# EAGLE design DataLogger.ver1 (EAGLE 9.6.2)
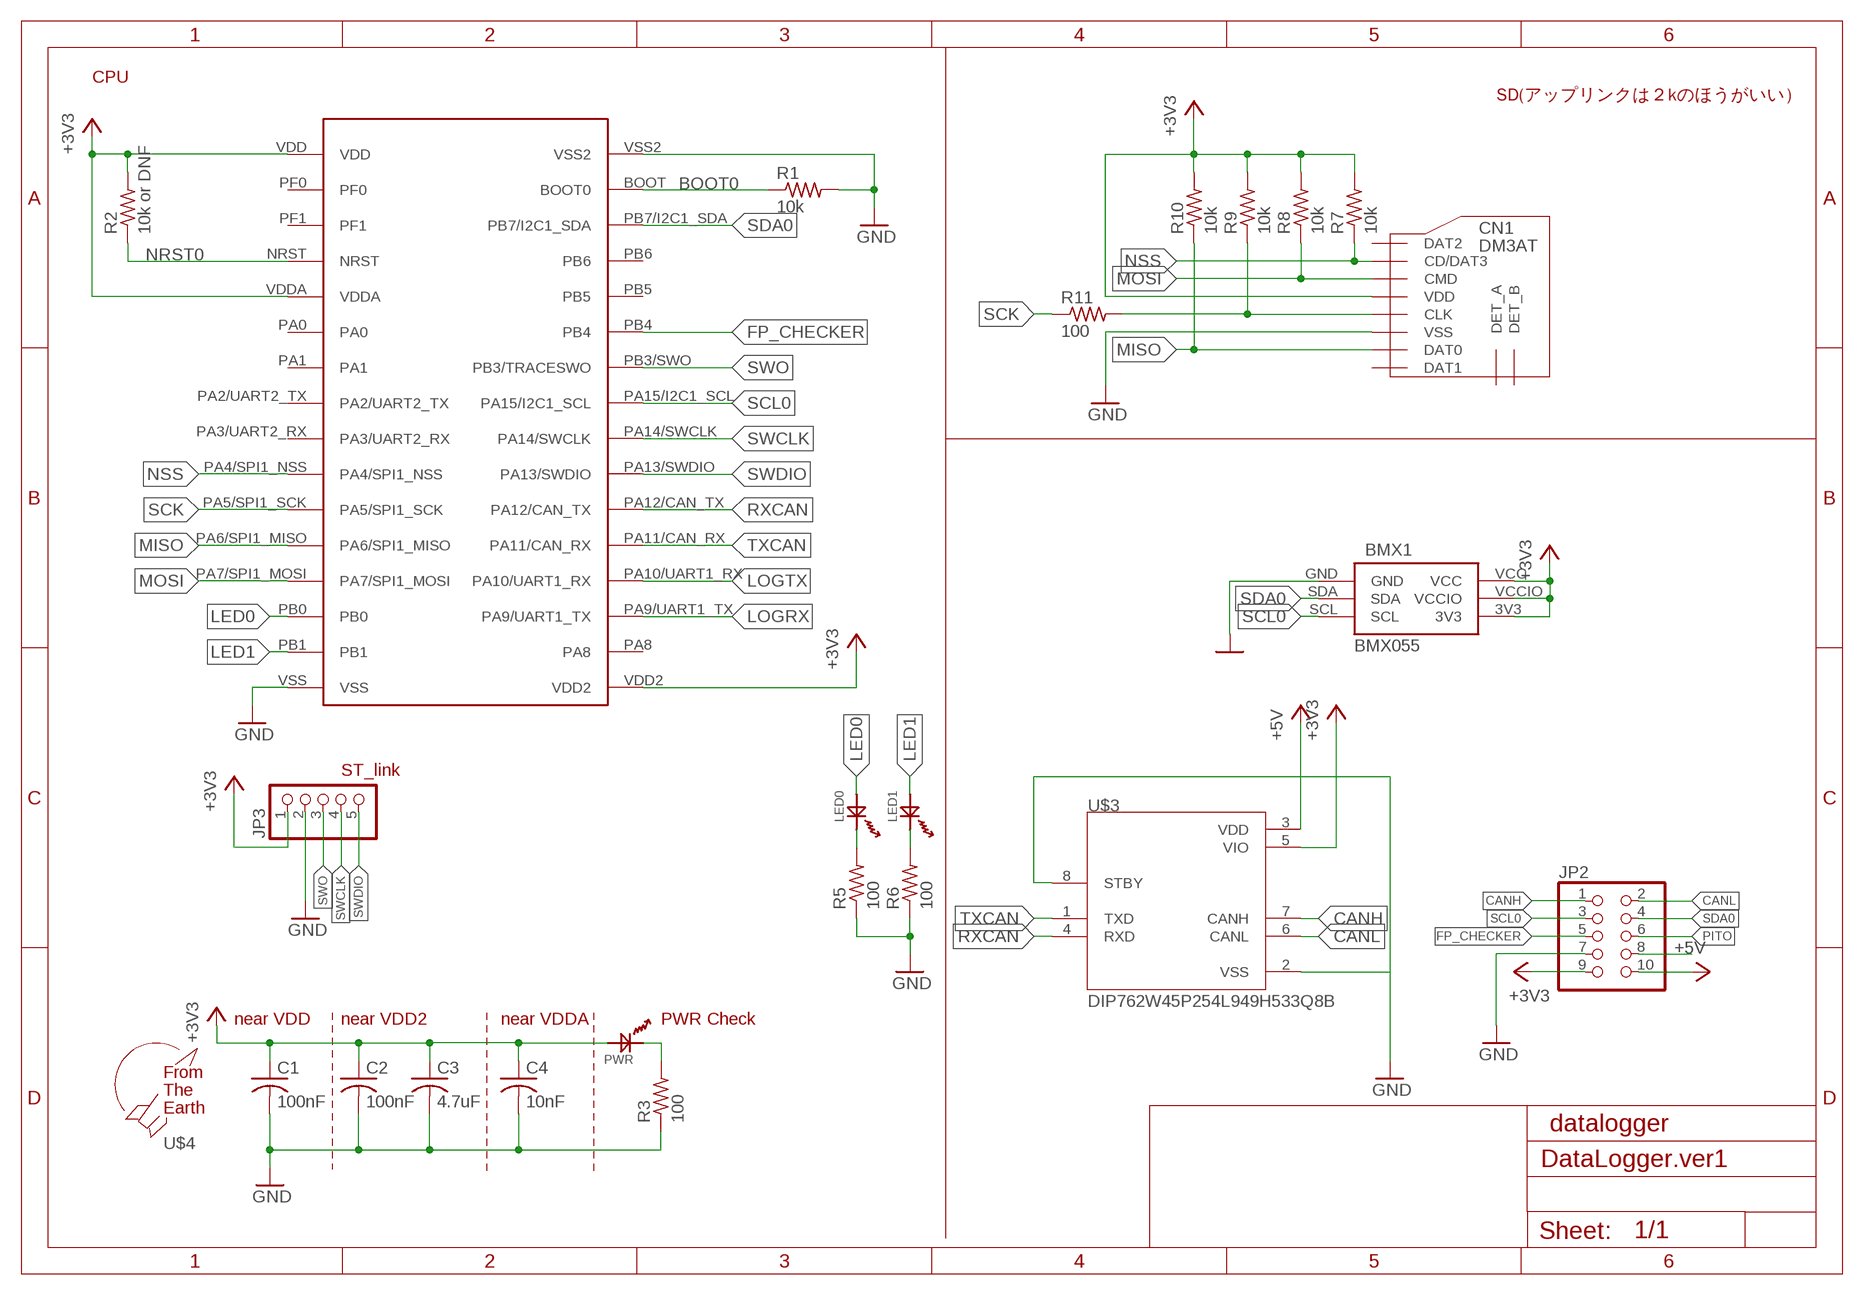
[diagram p0: schematic, sheet 1]

## Parts
BMX1  BMX055  [BMX055]
C1  100nF  C-USC1608  [C1608]
C2  100nF  C-USC1608  [C1608]
C3  4.7uF  C-USC1608  [C1608]
C4  10nF  C-USC1608  [C1608]
CN1  DM3AT  [DM3AT]
JP2  PINHD-2X5/90  [2X05/90]
JP3  PINHD-1X5/90  [1X05/90]
LED0  OSXX1608C1A  [OSXX1608C1A]
LED1  OSXX1608C1A  [OSXX1608C1A]
PWR  OSXX1608C1A  [OSXX1608C1A]
R1  10k  R-US_R0603  [R0603]
R2  10k or DNF  R-US_R0603  [R0603]
R3  100  R-US_R0603  [R0603]
R5  100  R-US_R0603  [R0603]
R6  100  R-US_R0603  [R0603]
R7  10k  R-US_R0603  [R0603]
R8  10k  R-US_R0603  [R0603]
R9  10k  R-US_R0603  [R0603]
R10  10k  R-US_R0603  [R0603]
R11  100  R-US_R0603  [R0603]
STM0  STM32F303K8  [STM32F303K8]
U$3  DIP762W45P254L949H533Q8B  [DIP762W45P254L949H533Q8B]
U$4  F.T.E.LOGO  [LOGO]

## Nets
+3V3: BMX1.3V3 BMX1.VCC BMX1.VCCIO C1.1 C2.1 C3.1 C4.1 CN1.VDD JP2.9 JP3.1 PWR.AN R2.2 R7.2 R8.2 R9.2 R10.2 STM0.VDD STM0.VDD2 STM0.VDDA U$3.5(VIO)
+5V: JP2.10 U$3.3(VDD)
BOOT0: R1.1 STM0.BOOT(BOOT0)
CANH: JP2.1 U$3.7(CANH)
CANL: JP2.2 U$3.6(CANL)
FP_CHECKER: JP2.5 STM0.PB4
GND [im]: BMX1.GND C1.2 C2.2 C3.2 C4.2 CN1.VSS JP2.7 JP3.2 R1.2 R3.1 R5.1 R6.1 STM0.VSS STM0.VSS2 U$3.2(VSS) U$3.8(STBY)
LED0: LED0.AN STM0.PB0
LED1: LED1.AN STM0.PB1
LOGRX: STM0.PA9/UART1_TX
LOGTX: STM0.PA10/UART1_RX
MISO: CN1.DAT0 R10.1 STM0.PA6/SPI1_MISO
MOSI: CN1.CMD R8.1 STM0.PA7/SPI1_MOSI
N$1: PWR.CT R3.2
N$2: LED0.CT R5.2
N$4: LED1.CT R6.2
N$7: CN1.CLK R9.1 R11.2
N$11: JP2.8
NRST0: R2.1 STM0.NRST
NSS: CN1.CD/DAT3 R7.1 STM0.PA4/SPI1_NSS
PITO: JP2.6
RXCAN: STM0.PA12/CAN_TX U$3.4(RXD)
SCK: R11.1 STM0.PA5/SPI1_SCK
SCL0: BMX1.SCL JP2.3 STM0.PA15/I2C1_SCL
SDA0: BMX1.SDA JP2.4 STM0.PB7/I2C1_SDA
SWCLK: JP3.4 STM0.PA14/SWCLK
SWDIO: JP3.5 STM0.PA13/SWDIO
SWO: JP3.3 STM0.PB3/SWO(PB3/TRACESWO)
TXCAN: STM0.PA11/CAN_RX U$3.1(TXD)
Unconnected: CN1.DAT1 CN1.DAT2 CN1.DET_A CN1.DET_B STM0.PA0 STM0.PA1 STM0.PA2/UART2_TX STM0.PA3/UART2_RX STM0.PA8 STM0.PB5 STM0.PB6 STM0.PF0 STM0.PF1

## Notes on the sheet
- CPU
- SD(アップリンクは２kのほうがいい）
- ST_link
- near VDD | near VDD2 | near VDDA | PWR Check
- datalogger

## Library data of the parts
BMX1 = BMX055:BMX055
C1-C4 = rcl:C-US: CAPACITOR, American symbol; SPICEPREFIX: C
CN1 = microSD:DM3AT
JP2 = pinhead:PINHD-2X5: PIN HEADER
JP3 = pinhead:PINHD-1X5: PIN HEADER
LED0 LED1 PWR = Chip LED:OSXX1608C1A
R1-R3 R5-R11 = rcl:R-US_: RESISTOR, American symbol; SPICEPREFIX: R
STM0 = STM32F303K8:STM32F303K8
U$3 = MCP2562-E_P:DIP762W45P254L949H533Q8B
U$4 = logo:F.T.E.LOGO

## Net classes
0 default: width 0.406 mm

## Board
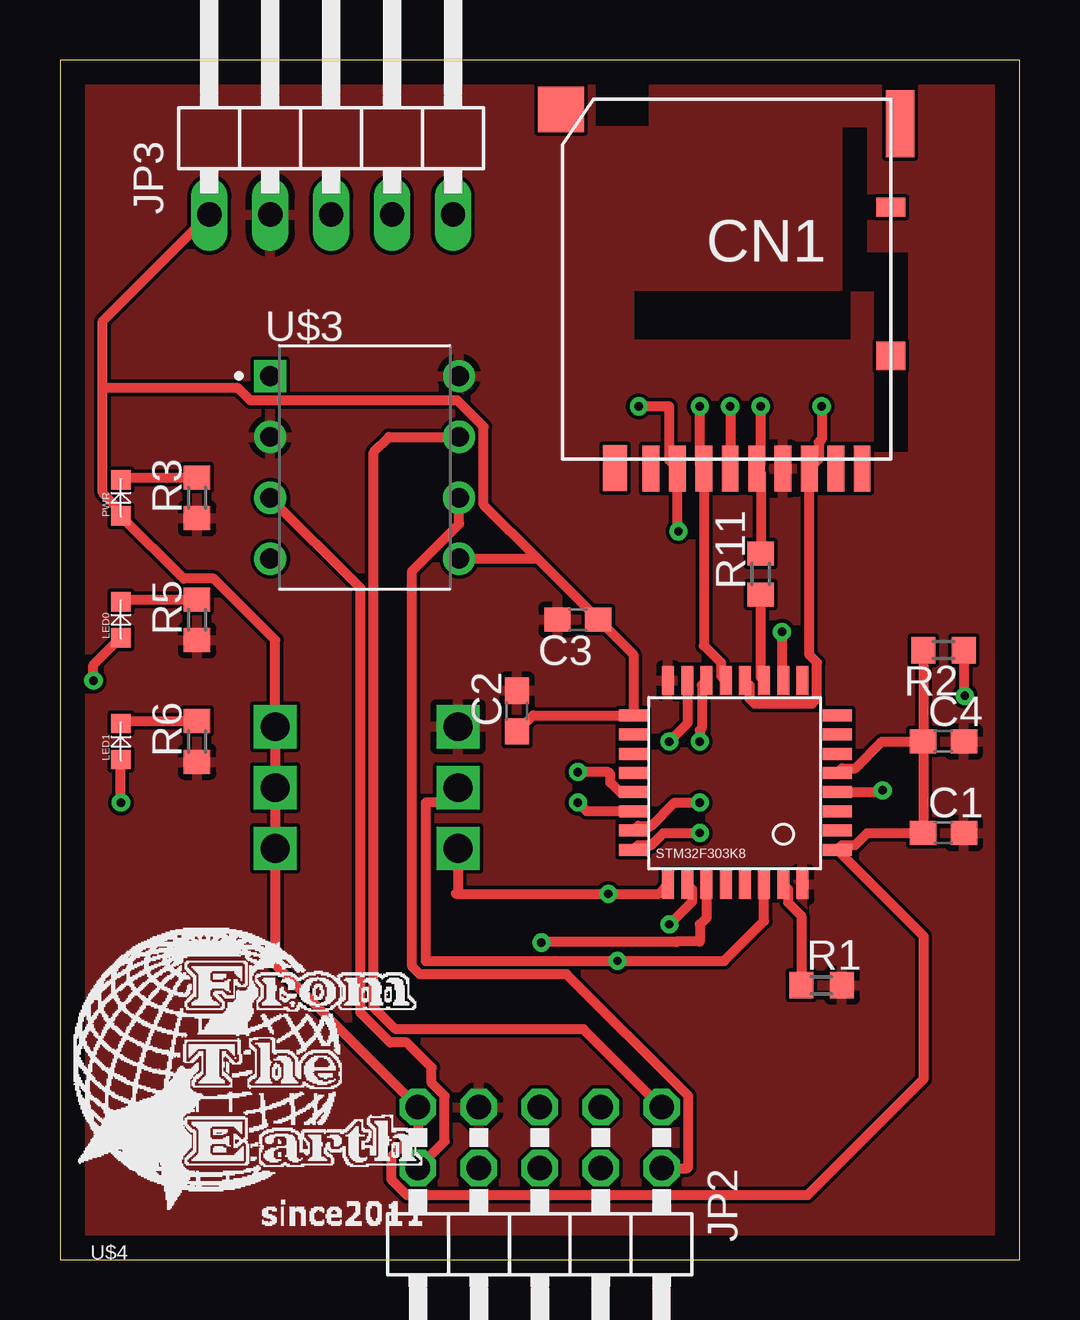
[diagram p1: board, top side]
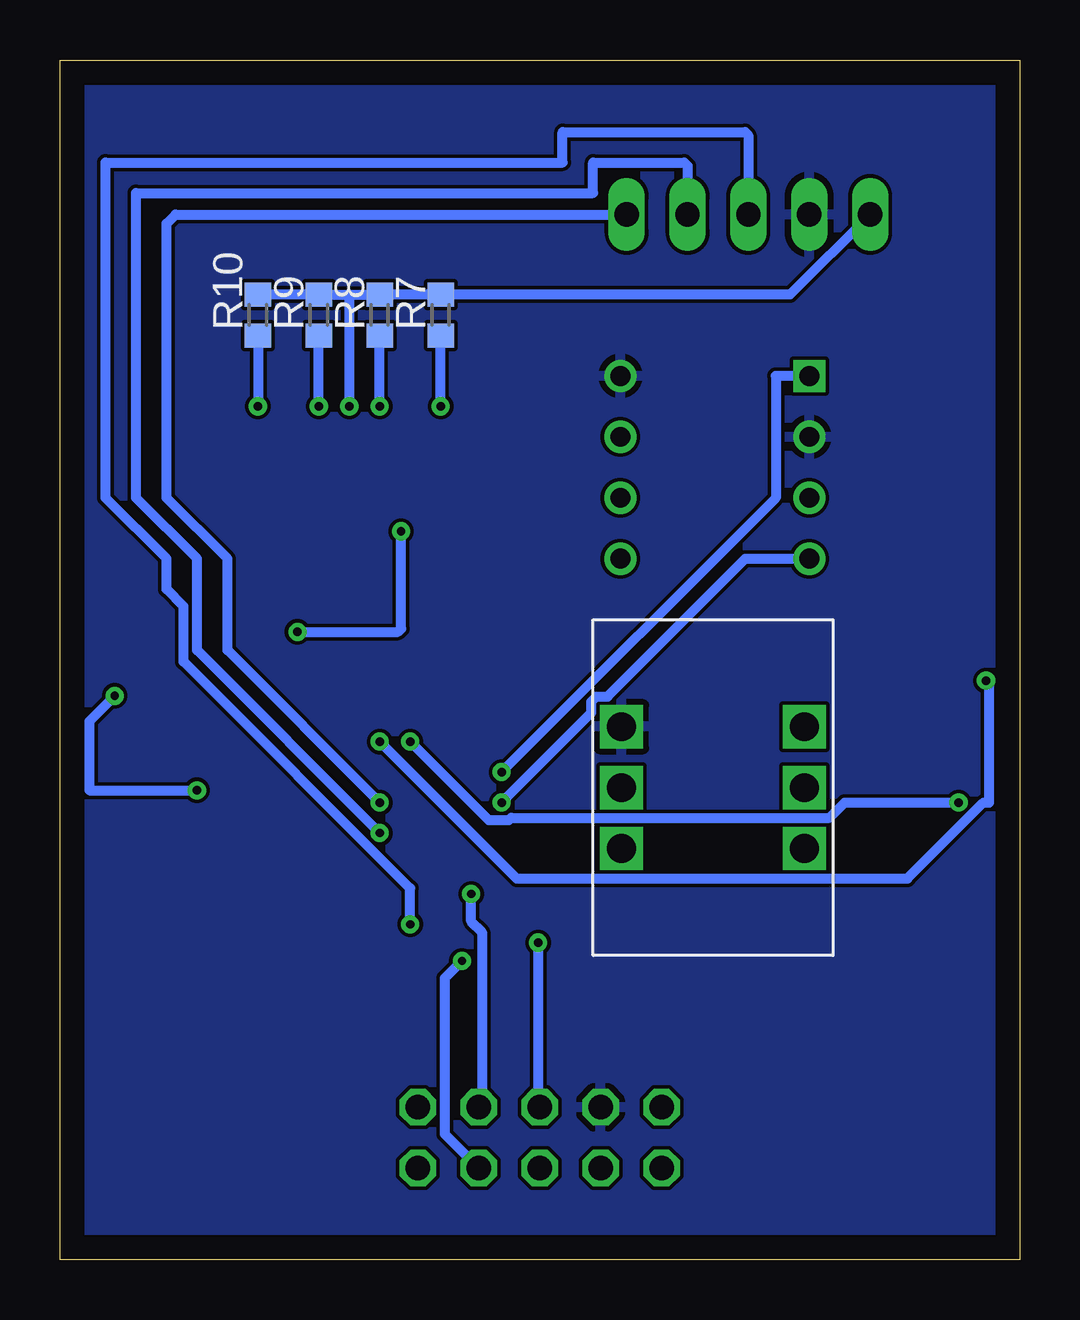
[diagram p2: board, bottom side, seen from below]

Size 40 x 50 mm. Coordinates in mm from the lower left corner, seen from the top.
Outline: 0,0 40,0 40,50 0,50 0,0
Copper layers (1*16): Top 0.035mm / dielectric 1.5mm / Bottom 0.035mm
Design rules "default": minimum track width 6mil, minimum drill 0.35mm, track to track 6mil, track to pad 6mil, pad to pad 6mil, via to via 6mil, smd to smd 6mil, copper to edge 40mil, drill to drill 6mil, minimum pad ring 10mil, minimum via ring 8mil, stop-mask expansion 4mil, vias tented up to drill 0mil, thermal gap 10mil

### Footprints (pad centres in the part's own frame; a part is rotated, then mirrored left to right if it is on the bottom)
BMX055 = drill 1.2 pad 1.5 square: 3V3 8.81,-9.53; GND 1.19,-4.46; SCL 1.19,-9.53; SDA 1.19,-7; VCC 8.81,-4.46; VCCIO 8.81,-7
C1608 = smd 1.1 x 1: 1 -0.85,0; 2 0.85,0
DM3AT = smd 0.7 x 1.9: CD/DAT3 2.2,6.4; CLK -1.1,6.4; CMD 1.1,6.4; DAT0 -3.3,6.4; DAT1 -4.4,6.4; DAT2 3.3,6.4; DET_B -5.5,6.4; VDD 0,6.4; VSS -2.2,6.4 | smd 1.2 x 0.8: DET_A -6.7,-4.5 | smd 1 x 1.9: P$9 4.8,6.381 | smd 1.2 x 1.2: P$11 -6.7,1.7 | smd 1.2 x 2.8: P$13 -7.081,-7.973 | smd 1.9 x 1.9: P$14 7.054,-8.562
2X05/90 = drill 1.016 octagon: 1 -5.08,-6.35; 2 -5.08,-3.81; 3 -2.54,-6.35; 4 -2.54,-3.81; 5 0,-6.35; 6 0,-3.81; 7 2.54,-6.35; 8 2.54,-3.81; 9 5.08,-6.35; 10 5.08,-3.81
1X05/90 = drill 1.016 long: 1 -5.08,-3.81; 2 -2.54,-3.81; 3 0,-3.81; 4 2.54,-3.81; 5 5.08,-3.81
OSXX1608C1A = smd 0.8 x 0.8: AN -0.75,0; CT 0.75,0
R0603 = smd 1 x 1.1: 1 -0.85,0; 2 0.85,0
STM32F303K8 = smd 0.5 x 1.2: BOOT 1.6,8.5; PA3/UART2_RX 0.8,0; PA4/SPI1_NSS 1.6,0; PA5/SPI1_SCK 2.4,0; PA6/SPI1_MISO 3.2,0; PA7/SPI1_MOSI 4,0; PA15/I2C1_SCL 6.4,8.5; PB0 4.8,0; PB1 5.6,0; PB3/SWO 5.6,8.5; PB4 4.8,8.5; PB5 4,8.5; PB6 3.2,8.5; PB7/I2C1_SDA 2.4,8.5; VSS 0.8,8.5; VSS2 6.4,0 | smd 1.2 x 0.5: NRST -0.65,4.65; PA0 -0.65,3.05; PA1 -0.65,2.25; PA2/UART2_TX -0.65,1.45; PA8 7.85,2.25; PA9/UART1_TX 7.85,3.05; PA10/UART1_RX 7.85,3.85; PA11/CAN_RX 7.85,4.65; PA12/CAN_TX 7.85,5.45; PA13/SWDIO 7.85,6.25; PA14/SWCLK 7.85,7.05; PF0 -0.65,6.25; PF1 -0.65,5.45; VDD -0.65,7.05; VDD2 7.85,1.45; VDDA -0.65,3.85
DIP762W45P254L949H533Q8B = drill 0.83 square: 1 -3.937,3.81 | drill 0.83: 2 -3.937,1.27; 3 -3.937,-1.27; 4 -3.937,-3.81; 5 3.937,-3.81; 6 3.937,-1.27; 7 3.937,1.27; 8 3.937,3.81

### Placement (x,y rotation side)
BMX1  17.78,26.67 0 bottom
C1  36.83,17.78 0 top
C2  19.05,22.86 90 top
C3  21.59,26.67 180 top
C4  36.83,21.59 0 top
CN1  27.94,39.37 180 top
JP2  20,0 180 top
JP3  11.3,47.37 0 top
LED0  2.54,26.67 90 top
LED1  2.54,21.59 90 top
PWR  2.54,31.75 90 top
R1  31.75,11.43 0 top
R2  36.83,25.4 180 top
R3  5.71,31.75 90 top
R5  5.71,26.67 90 top
R6  5.71,21.59 90 top
R7  24.13,39.37 90 bottom
R8  26.67,39.37 90 bottom
R9  29.21,39.37 90 bottom
R10  31.75,39.37 90 bottom
R11  29.21,28.57 90 top
STM0  31.75,24.13 180 top
U$3  12.7,33.02 0 top
U$4  0,0 0 top

### Tracks (layer width: path | path; a pad name or v marks a point on that pad's centre or on a via)
+3V3  (via drill 0.35)
  Top 0.406: v27.94,35.56 CN1.VDD | C2.1 19.72,22.68 STM0.VDD2 23.9,25.21 C3.1 19.9,29.21 | 1.78,36.32 1.78,31.95 2.54,31.2 PWR.AN 5.16,28.38 6.41,28.38 8.97,25.82 BMX1.VCC BMX1.VCCIO BMX1.3V3 8.97,12.3 JP2.9 14.92,5.39 13.8,4.27 13.8,3.35 14.46,2.69 31.17,2.69 36,7.52 36,13.48 STM0.VDD 32.59,17.27 33.15,17.27 33.65,17.78 C1.1 C4.1 | 1.78,36.32 1.78,39.12 JP3.1 | U$3.5 19.9,29.21 | 19.9,29.21 17.66,31.45 17.66,34.71 16.57,35.8 7.95,35.8 7.43,36.32 1.78,36.32 | STM0.VDDA 32.59,20.47 33.15,20.47 34.26,21.59 C4.1 | R2.2 C4.1
  Bottom 0.406: 27.94,40.22 R9.2 R10.2 | 27.94,40.22 R8.2 R7.2 9.56,40.22 JP3.1 | 27.94,40.22 v27.94,35.56
+5V
  Top 0.406: JP2.10 16.04,4.93 16.04,6.81 15.49,7.36 15.49,8 14.45,9.04 13.76,9.04 12.52,10.28 12.52,27.99 U$3.3
BOOT0
  Top 0.406: STM0.BOOT 30.34,15.44 30.34,14.88 30.9,14.33 R1.1
CANH
  Top 0.406: JP2.1 21.83,9.6 13.99,9.6 13.08,10.51 13.08,33.66 13.72,34.29 U$3.7
CANL
  Top 0.406: U$3.6 16.64,30.66 14.68,28.7 14.68,12.21 15.01,11.89 21.12,11.89 26.2,6.81 26.2,3.85 26.16,3.81 JP2.2
FP_CHECKER  (via drill 0.35)
  Top 0.406: STM0.PB4 26.95,14.25 26.67,13.97 26.67,13.26 25.73,13.26 25.7,13.24 20.09,13.24 v20.07,13.21
  Bottom 0.406: v20.07,13.21 20.07,6.42 JP2.5
GND
  pour Top: -1.27,-1.27 41.91,-1.27 41.91,50.8 -1.27,50.8
  pour Bottom: -1.27,-1.27 41.91,-1.27 41.91,50.8 -1.27,50.8
LED0  (via drill 0.35)
  Top 0.406: STM0.PB0 26.76,23.94 26.76,22.16 26.67,22.07 v26.67,21.59 | v1.39,24.13 1.39,24.77 LED0.AN
  Bottom 0.406: v26.67,21.59 20.96,15.88 4.67,15.88 1.5,19.05 1.27,19.05 1.27,24.13 v1.39,24.13
LED1  (via drill 0.35)
  Top 0.406: STM0.PB1 26.15,22.34 v25.4,21.59 | v2.54,19.05 LED1.AN
  Bottom 0.406: v2.54,19.05 7.29,19.05 7.92,18.41 21.19,18.41 21.29,18.32 22.13,18.32 v25.4,21.59
MISO  (via drill 0.35)
  Top 0.406: v31.75,35.56 31.75,34.18 31.63,34.07 31.63,33.36 CN1.DAT0 31.24,25.19 31.56,24.88 31.56,23.38 31.35,23.17 28.95,23.17 28.74,23.38 28.74,23.94 STM0.PA6/SPI1_MISO
  Bottom 0.406: R10.1 v31.75,35.56
MOSI  (via drill 0.35)
  Top 0.406: v26.67,35.56 26.67,33.14 CN1.CMD 26.84,25.59 27.56,24.88 27.56,24.32 STM0.PA7/SPI1_MOSI
  Bottom 0.406: v26.67,35.56 R8.1
N$1
  Top 0.406: PWR.CT 2.64,32.6 R3.2
N$2
  Top 0.406: LED0.CT 2.64,27.52 R5.2
N$4
  Top 0.406: LED1.CT 2.64,22.44 R6.2
N$7  (via drill 0.35)
  Top 0.406: v29.21,35.56 29.21,33.14 CN1.CLK 29.21,32.8 R11.2
  Bottom 0.406: v29.21,35.56 R9.1
NRST0  (via drill 0.35)
  Top 0.406: STM0.NRST 34.09,19.48 34.16,19.56 v34.29,19.56 | R2.1 37.68,23.53 v37.72,23.5
  Bottom 0.406: v34.29,19.56 38.78,19.56 38.78,22.43 v37.72,23.5
NSS  (via drill 0.35)
  Top 0.406: v24.13,35.56 25.4,35.56 25.4,33.31 CN1.CD/DAT3 25.74,30.39 v25.78,30.35 | v30.1,26.16 30.1,24.18 STM0.PA4/SPI1_NSS
  Bottom 0.406: v24.13,35.56 R7.1 | v30.1,26.16 25.91,26.16 25.78,26.29 v25.78,30.35
RXCAN  (via drill 0.35)
  Top 0.406: STM0.PA12/CAN_TX 21.96,18.68 v21.59,19.05
  Bottom 0.406: v21.59,19.05 17.85,22.79 17.85,23.26 17.64,23.47 17.17,23.47 11.43,29.21 U$3.4
SCK
  Top 0.406: STM0.PA5/SPI1_SCK 29.21,24.27 R11.1
SCL0  (via drill 0.35)
  Top 0.406: BMX1.SCL 16.59,15.32 16.51,15.24 v22.86,15.24 24.96,15.24 STM0.PA15/I2C1_SCL
  Bottom 0.406: JP2.3 22.41,6.48 22.41,13.65 22.86,14.1 v22.86,15.24
SDA0  (via drill 0.35)
  Top 0.406: BMX1.SDA 15.97,19.05 15.24,19.05 15.24,12.45 v23.24,12.45 27.69,12.45 29.35,14.11 STM0.PB7/I2C1_SDA
  Bottom 0.406: JP2.4 23.96,5.23 23.96,11.72 v23.24,12.45
SWCLK  (via drill 0.35)
  Top 0.406: STM0.PA14/SWCLK 24.09,17.27 24.65,17.27 25.15,17.78 v26.67,17.78
  Bottom 0.406: v26.67,17.78 34.29,25.4 34.29,29.21 36.83,31.75 36.83,44.45 17.78,44.45 17.78,45.72 13.97,45.72 13.84,45.59 JP3.4
SWDIO  (via drill 0.35)
  Top 0.406: STM0.PA13/SWDIO 24.09,18.07 24.65,18.07 25.62,19.05 v26.67,19.05
  Bottom 0.406: v26.67,19.05 33.02,25.4 33.02,29.21 35.56,31.75 35.56,43.18 35.18,43.56 JP3.5
SWO  (via drill 0.35)
  Top 0.406: STM0.PB3/SWO 26.34,15.44 26.34,14.91 v25.4,13.97
  Bottom 0.406: v25.4,13.97 25.4,15.47 34.85,24.92 34.85,27.23 35.56,27.94 35.56,29.21 38.1,31.75 38.1,45.72 19.05,45.72 19.05,46.99 11.43,46.99 11.3,46.86 JP3.3
TXCAN  (via drill 0.35)
  Top 0.406: STM0.PA11/CAN_RX 23.35,19.48 22.94,19.88 22.94,20.24 22.86,20.32 v21.59,20.32
  Bottom 0.406: v21.59,20.32 10.16,31.75 10.16,36.83 U$3.1